# EAGLE design arduino_NGDM (EAGLE 4.14)
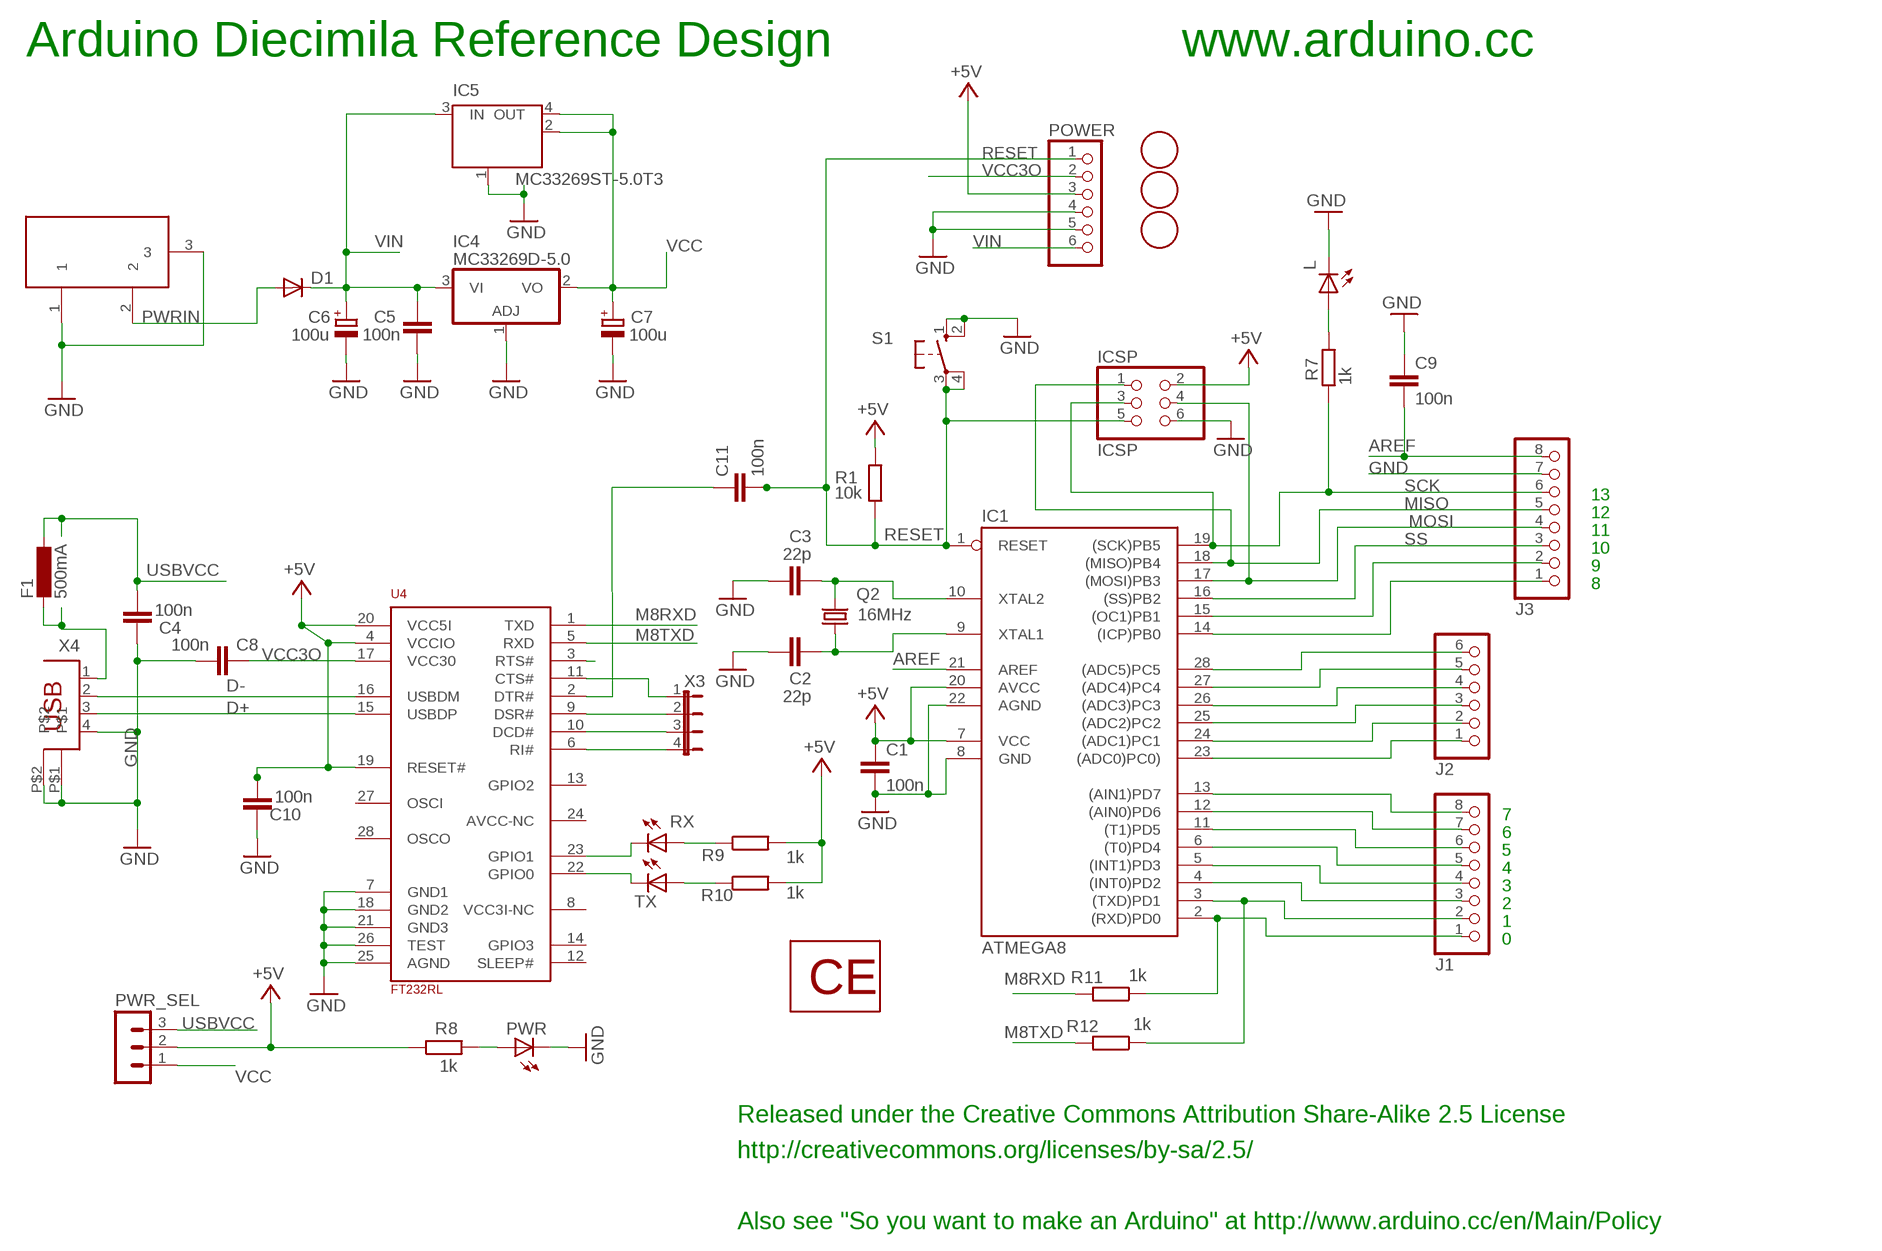
[diagram p0: schematic, sheet 1]

## Parts
C1  100n  C-EU  [C0805RND]
C2  22p  C-EU  [C0805RND]
C3  22p  C-EU  [C0805RND]
C4  100n  C-EU  [C0805RND]
C5  100n  C-EU  [C0805RND]
C6  100u  CPOL-EUD  [PANASONIC_D]
C7  100u  CPOL-EUD  [PANASONIC_D]
C8  100n  C-EU  [C0805RND]
C9  100n  C-EU  [C0805RND]
C10  100n  C-EU  [C0805RND]
C11  100n  C-EU  [C0805RND]
D1  DIODE-SMB  [SMB]
F1  500mA  L-EUL1812  [L1812]
IC1  ATMEGA8  AT90S4433P  [DIL28-3]
IC4  MC33269D-5.0  [DPACK]
IC5  MC33269ST-5.0T3  MC33269ST-3.3T3  [SOT223]
ICSP  ICSP  PINHD-2X3  [2X03]
J1  PINHD-1X8  [1X08]
J2  PINHD-1X6  [1X06]
J3  PINHD-1X8  [1X08]
L  LED0805ROUND  [0805RND]
POWER  PINHD-1X6  [1X06]
PWR  LED0805ROUND  [0805RND]
PWR_SEL  MA03-1  [MA03-1]
Q2  16MHz  CRYTALHC49S  [HC49/S]
R1  10k  R-EU_  [R0805RND]
R7  1k  R-EU_  [R0805RND]
R8  1k  R-EU_  [R0805RND]
R9  1k  R-EU_  [R0805RND]
R10  1k  R-EU_  [R0805RND]
R11  1k  R-EU_  [R0805RND]
R12  1k  R-EU_  [R0805RND]
RX  LED0805ROUND  [0805RND]
S1  10-XX  [B3F-10XX]
TX  LED0805ROUND  [0805RND]
U4  FT232RL  [SSOP28]
U$1  FIDUCIALMOUNT  [FIDUCIA-MOUNT]
U$2  FIDUCIALMOUNT  [FIDUCIA-MOUNT]
U$3  FIDUCIALMOUNT  [FIDUCIA-MOUNT]
U$4  CE  [CE-COPPER]
X2  DC21MMX  [DC-21MM]
X3  JP4E  [JP4]
X4  PN61729  [PN61729]

## Nets
+5V [usbvcc]: C1.1 C10.1 IC1.7(VCC) IC1.20(AVCC) ICSP.2 POWER.3 PWR_SEL.2 R1.2 R8.1 R9.2 R10.2 U4.4(VCCIO) U4.19(RESET#) U4.20(VCC5I)
AREF [aref]: C9.2 IC1.21(AREF) J3.8
D+: U4.15(USBDP) X4.3
D-: U4.16(USBDM) X4.2
GND [gnd]: C1.2 C2.1 C3.1 C4.2 C5.1 C6.- C7.- C8.1 C9.1 C10.2 IC1.8(GND) IC1.22(AGND) IC4.1(ADJ) IC5.1(GND/ADJ) ICSP.6 J3.7 L.P$2(C) POWER.4 POWER.5 PWR.P$2(C) S1.1(S) S1.2(S1) U4.7(GND1) U4.18(GND2) U4.21(GND3) U4.25(AGND) U4.26(TEST) X2.1 X2.3 X4.4 X4.P$1 X4.P$2
M8RXD: R11.2 U4.1(TXD)
M8TXD: R12.2 U4.5(RXD)
MISO: IC1.18((MISO)PB4) ICSP.1 J3.5
MOSI: IC1.17((MOSI)PB3) ICSP.4 J3.4
N$2: L.P$1(A) R7.1
N$3: PWR.P$1(A) R8.2
N$5: IC1.14((ICP)PB0) J3.1
N$6: C2.2 IC1.9(XTAL1) Q2.1
N$7: C3.2 IC1.10(XTAL2) Q2.2
N$8 [usbvcc]: F1.2 X4.1
N$9: U4.3(RTS#)
N$10: IC1.4((INT0)PD2) J1.3
N$11: IC1.5((INT1)PD3) J1.4
N$12: IC1.6((T0)PD4) J1.5
N$13: IC1.11((T1)PD5) J1.6
N$14: IC1.12((AIN0)PD6) J1.7
N$15: IC1.13((AIN1)PD7) J1.8
N$16: IC1.23((ADC0)PC0)) J2.1
N$17: IC1.24((ADC1)PC1) J2.2
N$18: IC1.25((ADC2)PC2) J2.3
N$19: IC1.26((ADC3)PC3) J2.4
N$20: IC1.27((ADC4)PC4) J2.5
N$21: IC1.28((ADC5)PC5) J2.6
N$22: IC1.15((OC1)PB1) J3.2
N$24: C11.1 U4.2(DTR#)
N$32: RX.P$2(C) U4.23(GPIO1)
N$34: TX.P$2(C) U4.22(GPIO0)
N$35: R9.1 RX.P$1(A)
N$36: R10.1 TX.P$1(A)
N$37: U4.6(RI#) X3.4
N$38: U4.10(DCD#) X3.3
N$39: U4.11(CTS#) X3.1
N$40: U4.9(DSR#) X3.2
PD0: IC1.2((RXD)PD0) J1.1 R11.1
PD1: IC1.3((TXD)PD1) J1.2 R12.1
PWRIN [power]: D1.A X2.2
RESET: C11.2 IC1.1(RESET) ICSP.5 POWER.1 R1.1 S1.3(P) S1.4(P1)
SCK: IC1.19((SCK)PB5) ICSP.3 J3.6 R7.2
SS: IC1.16((SS)PB2) J3.3
USBVCC [usbvcc]: C4.1 F1.1 PWR_SEL.3
VCC [usbvcc]: C7.+ IC4.2(VO) IC5.2(OUT) IC5.4(OUT) PWR_SEL.1
VCC3O: C8.2 POWER.2 U4.17(VCC30)
VIN [power]: C5.2 C6.+ D1.C IC4.3(VI) IC5.3(IN) POWER.6
Unconnected: U4.8(VCC3I-NC) U4.12(SLEEP#) U4.13(GPIO2) U4.14(GPIO3) U4.24(AVCC-NC) U4.27(OSCI) U4.28(OSCO)

## Notes on the sheet
- Arduino Diecimila Reference Design | www.arduino.cc
- 13
- 12
- 11
- 10
- 9
- 8
- 7
- 6
- 5
- 4
- 3
- 2
- 1
- 0
- Released under the Creative Commons Attribution Share-Alike 2.5 License
- http://creativecommons.org/licenses/by-sa/2.5/
- Also see "So you want to make an Arduino" at http://www.arduino.cc/en/Main/Policy

## Library data of the parts
C1-C5 C8-C11 = rcl:C-EU: CAPACITOR, European symbol
C6 C7 = rcl:CPOL-EU: POLARIZED CAPACITOR, European symbol
D1 = diode:DIODE-: DIODE
F1 = rcl:L-EU: INDUCTOR, European symbol
IC1 = atmel:AT90S4433: MICROCONTROLLER 4 Kbytes FLASH 128 bytes SRAM 256 bytes EEPROM UART 6-channel 10 bit ADC
IC4 = linear:MC33269?*: Adjustable Output Low Dropout Voltage Regulator 800 mA Source: http://www.onsemi.com/pub/Collateral/MC33269-D.PDF
IC5 = linear:MC33269ST*: Adjustable Output Low Dropout Voltage Regulator 800 mA Source: http://www.onsemi.com/pub/Collateral/MC33269-D.PDF
ICSP = pinhead:PINHD-2X3: PIN HEADER
J1 J3 = pinhead:PINHD-1X8: PIN HEADER
J2 POWER = pinhead:PINHD-1X6: PIN HEADER
L PWR RX TX = led:LED: LED OSRAM: - CHIPLED LG R971, LG N971, LY N971, LG Q971, LY Q971, LO R971, LY R971 LH N974, LH R974 LS Q976, LO Q976, LY Q976 LO Q996 - Hyper CHIPLED LW Q18S LB Q993, LB Q99A, LB R99A - SideLED LS A670, LO A670, LY A670, LG A670, LP A670 LB A673, LV A673, LT A673, LW A673 LH A674 LY A675 LS A676, LA A676, LO A676, LY A676, LW A676 LS A679, LY A679, LG A679 - Hyper Micro SIDELED® LS Y876, LA Y876, LO Y876, LY Y876 LT Y87S - SmartLED LW L88C, LW L88S LB L89C, LB L89S, LG L890 LS L89K, LO L89K, LY L89K LS L896, LA L896, LO L896, LY L896 - TOPLED LS T670, LO T670, LY T670, LG T670, LP T670 LSG T670, LSP T670, LSY T670, LOP T670, LYG T670 LG T671, LOG T671, LSG T671 LB T673, LV T673, LT T673, LW T673 LH T674 LS T676, LA T676, LO T676, LY T676, LB T676, LH T676, LSB T676, LW T676 LB T67C, LV T67C, LT T67C, LS T67K, LO T67K, LY T67K, LW E67C LS E67B, LA E67B, LO E67B, LY E67B, LB E67C, LV E67C, LT E67C LW T67C LS T679, LY T679, LG T679 LS T770, LO T770, LY T770, LG T770, LP T770 LB T773, LV T773, LT T773, LW T773 LH T774 LS E675, LA E675, LY E675, LS T675 LS T776, LA T776, LO T776, LY T776, LB T776 LHGB T686 LT T68C, LB T68C - Hyper Mini TOPLED® LB M676 - Mini TOPLED Santana® LG M470 LS M47K, LO M47K, LY M47K Source: http://www.osram.convergy.de/
PWR_SEL = con-lstb:MA03-1: PIN HEADER
Q2 = crystal:CRYTAL: CRYSTAL
R1 R7-R12 = rcl:R-EU_: RESISTOR, European symbol
S1 = switch-omron:10-XX: OMRON SWITCH
U4 = SmartPrj:FT232RL
U$1-U$3 = SmartPrj:FIDUCIALMOUNT
U$4 = SmartPrj:CE
X2 = powersupply:DC21MM
X3 = jumper:JP4E: JUMPER
X4 = SmartPrj:PN61729: BERG USB connector

## Net classes
0 default: width 0.254 mm, drill 0.254 mm
1 power: width 0.61 mm, drill 0.33 mm, clearance 0.711 mm
2 gnd: width 0.305 mm, drill 0.254 mm, clearance 0.711 mm
3 usbvcc: width 0.508 mm, drill 0.254 mm, clearance 0.711 mm
4 aref: width 0.406 mm

## Board
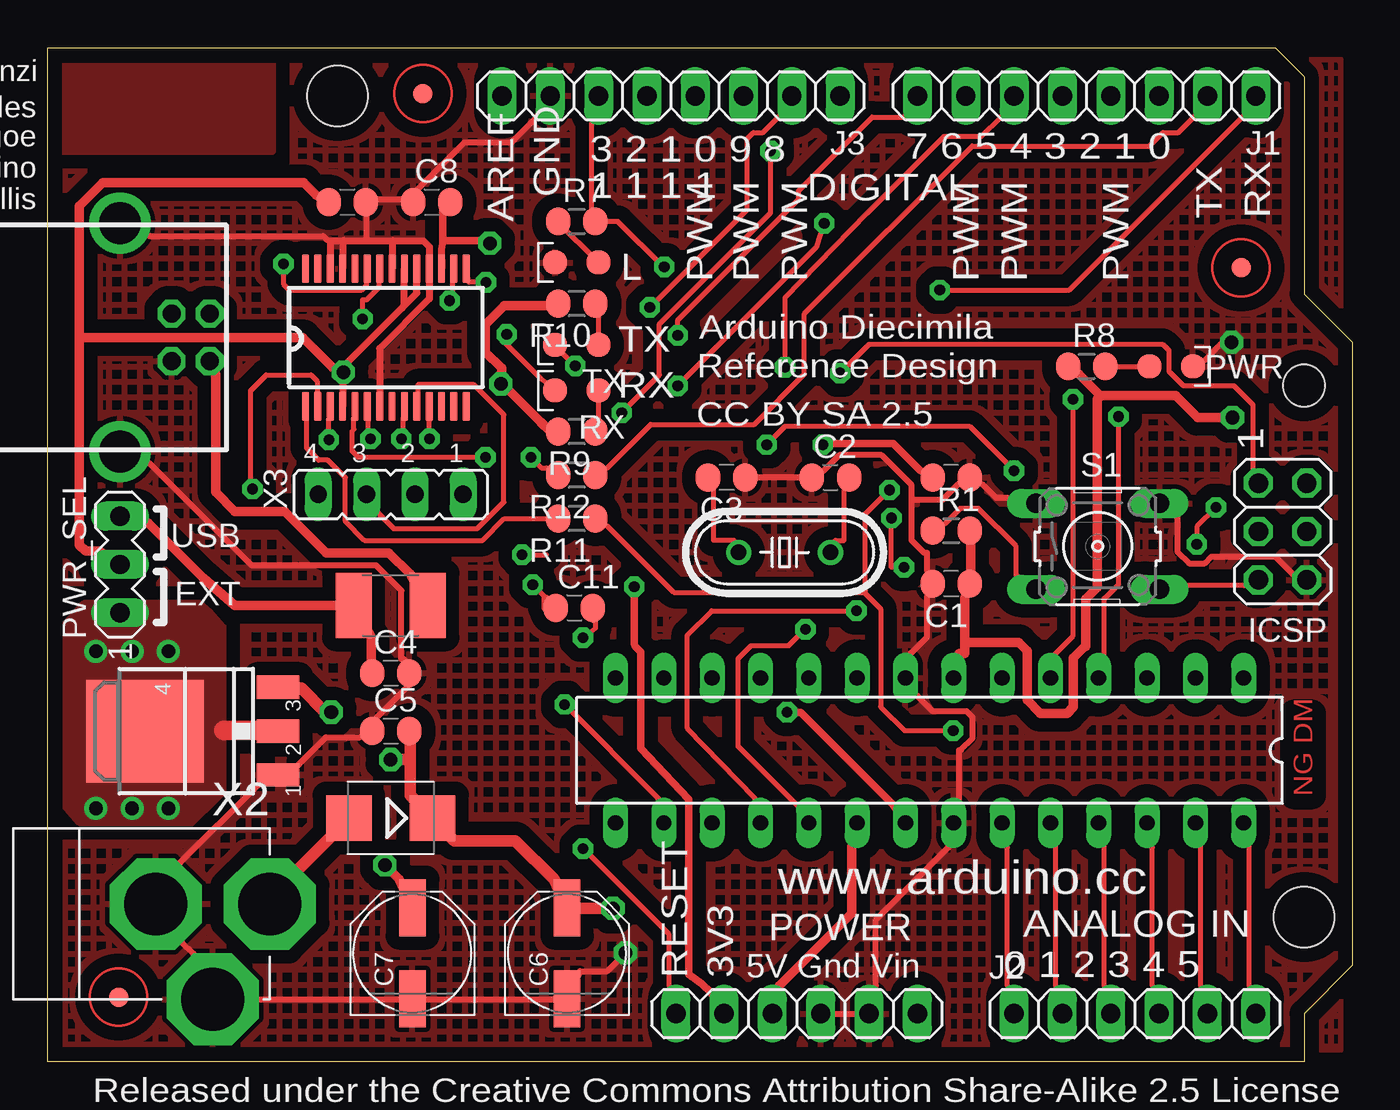
[diagram p1: board, top side]
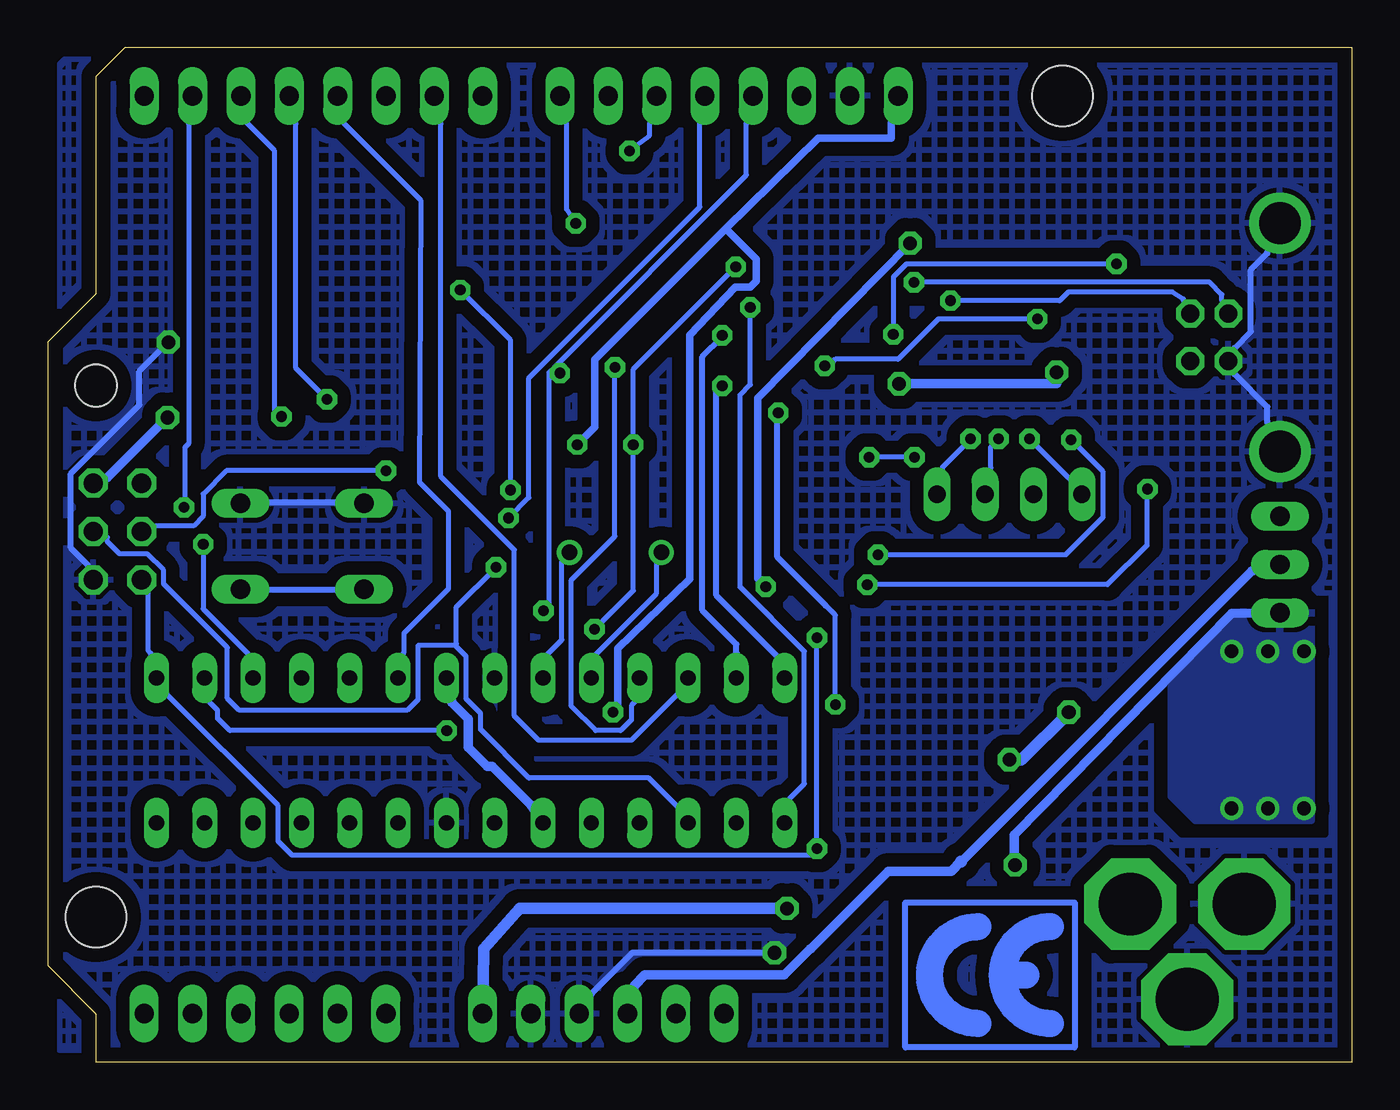
[diagram p2: board, bottom side, seen from below]

Size 68.58 x 53.34 mm. Coordinates in mm from the lower left corner, seen from the top.
Outline: 0,53.34 64.52,53.34 66.04,51.82 66.04,40.39 68.58,37.85 68.58,5.08 66.04,2.54 66.04,0 0,0 0,53.34
Copper layers (1*16): Top 0.035mm / dielectric 1.5mm / Bottom 0.035mm
Design rules "default": minimum track width 10mil, minimum drill 22mil, track to track 10mil, track to pad 10mil, pad to pad 10mil, via to via 16mil, smd to smd 8mil, copper to edge 30mil, drill to drill 12mil, minimum pad ring 10mil, minimum via ring 10mil, stop-mask expansion 4mil, vias tented up to drill 0mil, thermal gap 10mil
Holes 2.2 mm at 66.04,35.56
Holes 3.2 mm at 66.04,7.62 15.24,50.8
vRestrict: area 22.9,44.1 to 24.6,49.1; area 25.4,45.5 to 27.1,49.1; area 28.4,45.3 to 29.6,48.8; area 31,45.3 to 32.1,48.8; area 33.5,45.3 to 34.7,48.8; area 36.1,45.3 to 37.2,48.8; area 38.7,47.2 to 39.9,48.8; area 40.3,45.1 to 47.6,46.9; area 33.4,41 to 34.9,44.6; area 35.9,41 to 37.5,44.6; area 38.5,41 to 40,44.6; area 47.5,41 to 49,44.6; 37 more areas

### Footprints (pad centres in the part's own frame; a part is rotated, then mirrored left to right if it is on the bottom)
C0805RND = smd 1.3 x 1.5: 1 -0.977,0; 2 0.977,0
PANASONIC_D = smd 3 x 1.4: + 2.4,0; - -2.4,0
SMB = smd 2.4 x 2.4: A 2.2,0; C -2.2,0
L1812 = smd 1.9 x 3.4: 1 -1.95,0; 2 1.95,0
DIL28-3 = drill 0.813 long: 1 -16.51,-3.81; 2 -13.97,-3.81; 3 -11.43,-3.81; 4 -8.89,-3.81; 5 -6.35,-3.81; 6 -3.81,-3.81; 7 -1.27,-3.81; 8 1.27,-3.81; 9 3.81,-3.81; 10 6.35,-3.81; 11 8.89,-3.81; 12 11.43,-3.81; 13 13.97,-3.81; 14 16.51,-3.81; 15 16.51,3.81; 16 13.97,3.81; 17 11.43,3.81; 18 8.89,3.81; 19 6.35,3.81; 20 3.81,3.81; 21 1.27,3.81; 22 -1.27,3.81; 23 -3.81,3.81; 24 -6.35,3.81; 25 -8.89,3.81; 26 -11.43,3.81; 27 -13.97,3.81; 28 -16.51,3.81
DPACK = smd 1 x 1.6: 1 -2.28,-4.8; 3 2.28,-4.8 | smd 5.4 x 6.2: 2 0,2.5
SOT223 = smd 1.219 x 2.235: 1 -2.311,-3.099; 2 0,-3.099; 3 2.311,-3.099 | smd 3.6 x 2.2: 4 0,3.099
2X03 = drill 1.016 octagon: 1 -2.54,-1.27; 2 -2.54,1.27; 3 0,-1.27; 4 0,1.27; 5 2.54,-1.27; 6 2.54,1.27
1X08 = drill 1.016 long: 1 -8.89,0; 2 -6.35,0; 3 -3.81,0; 4 -1.27,0; 5 1.27,0; 6 3.81,0; 7 6.35,0; 8 8.89,0
1X06 = drill 1.016 long: 1 -6.35,0; 2 -3.81,0; 3 -1.27,0; 4 1.27,0; 5 3.81,0; 6 6.35,0
0805RND = smd 1.27 x 1.27: P$1 -1.143,0; P$2 1.143,0
MA03-1 = drill 1.016 long: 1 -2.54,0; 2 0,0; 3 2.54,0
HC49/S = drill 0.813 round: 1 -2.413,0; 2 2.413,0
R0805RND = smd 1.3 x 1.5: 1 -0.977,0; 2 0.977,0
B3F-10XX = drill 1.016 long: 1 -3.251,2.261; 2 3.251,2.261; 3 -3.251,-2.261; 4 3.251,-2.261
SSOP28 = smd 0.381 x 1.499: 1 -4.225,-3.625; 2 -3.575,-3.625; 3 -2.925,-3.625; 4 -2.275,-3.625; 5 -1.625,-3.625; 6 -0.975,-3.625; 7 -0.325,-3.625; 8 0.325,-3.625; 9 0.975,-3.625; 10 1.625,-3.625; 11 2.275,-3.625; 12 2.925,-3.625; 13 3.575,-3.625; 14 4.225,-3.625; 15 4.225,3.625; 16 3.575,3.625; 17 2.925,3.625; 18 2.275,3.625; 19 1.625,3.625; 20 0.975,3.625; 21 0.325,3.625; 22 -0.325,3.625; 23 -0.975,3.625; 24 -1.625,3.625; 25 -2.275,3.625; 26 -2.925,3.625; 27 -3.575,3.625; 28 -4.225,3.625
FIDUCIA-MOUNT = smd 1.016 x 1.016: P$1 0,0
DC-21MM = drill 3.302 pad 4.826 octagon: 1 -5.08,-3.353; 2 -0.076,-6.35; 3 -0.076,-0.356
JP4 = drill 0.914 long: 1 -3.81,0; 2 -1.27,0; 3 1.27,0; 4 3.81,0
PN61729 = drill 0.95 octagon: 1 1.25,4.71; 2 -1.25,4.71; 3 -1.25,2.71; 4 1.25,2.71 | drill 2.2 round: P$1 -6,0; P$2 6,0

### Placement (x,y rotation side)
C1  47.5,25.15 180 top
C2  41.15,30.73 0 top
C3  35.69,30.73 180 top
C4  18.03,20.45 0 top
C5  18.03,17.4 0 top
C6  27.3,5.71 90 top
C7  19.18,5.71 90 top
C8  20.19,45.21 0 top
C9  47.5,30.73 180 top
C10  15.75,45.21 0 top
C11  27.69,23.88 0 top
D1  18.03,12.83 180 top
F1  18.03,24 0 top
IC1  46.35,16.38 180 top
IC4  7.62,17.4 90 top
IC5  9.02,17.4 90 top
ICSP  64.91,27.89 270 top
J1  54.61,50.8 180 top
J2  57.15,2.54 0 top
J3  32.77,50.8 180 top
L  27.81,42.04 180 top
POWER  39.37,2.54 0 top
PWR  59.05,36.58 0 top
PWR_SEL  3.81,26.16 90 top
Q2  38.73,26.8 180 top
R1  47.5,27.94 0 top
R7  27.81,44.2 0 top
R8  54.61,36.58 0 top
R9  27.81,33.15 180 top
R10  27.81,39.88 180 top
R11  27.81,28.57 180 top
R12  27.81,30.86 180 top
RX  27.81,35.31 180 top
S1  55.2,27.11 0 top
TX  27.81,37.72 180 top
U4  17.78,38.1 0 top
U$1  19.73,50.92 0 top
U$2  62.73,41.76 0 top
U$3  3.73,3.41 0 top
U$4  23.5,0.76 0 bottom
X2  5.33,8.38 90 top
X3  18.03,29.84 180 top
X4  3.81,38.1 270 top

### Tracks (layer width: path | path; a pad name or v marks a point on that pad's centre or on a via)
+5V  (via drill 0.71)
  Top 0.381: U4.4 15.51,36.27 15.51,36.54 18.59,39.62 | 18.59,39.62 19.41,40.44 U4.19 19.41,41.68 | U4.20 18.75,39.79 18.59,39.62
  Top 0.508: 23.88,36.47 23.01,37.34 23.01,38.78 24.01,39.78 26.21,39.78 R10.2 | 23.88,36.47 23.88,35.69 25.91,33.66 26.39,33.2 R9.2 | v23.82,35.66 23.88,36.47 | 15.51,36.27 v15.54,36.27 14.99,36.52 13.41,38.1 1.68,38.1 | 1.68,38.1 1.68,45.01 2.9,46.23 13.46,46.23 14.12,45.57 C10.1 | 1.68,38.1 1.68,27.19 1.99,26.87 2.69,26.87 PWR_SEL.2 | 55.32,35.05 54.2,36.17 R8.1 | 55.32,35.05 59.28,35.05 60.45,33.88 v62.28,33.88 | R1.2 48.51,27.23 48.51,25.86 C1.1 48.21,24.43 48.21,22.05 | 48.21,22.05 48.21,21.49 47.9,21.49 IC1.7 | POWER.3 38.46,4.01 42.27,7.82 42.27,11.28 IC1.20 | 55.32,35.05 55.17,34.85 55.17,24.94 54.56,24.33 54.56,21.84 54.51,21.84 53.9,21.23 53.9,18.66 53.58,18.34 52.17,18.34 51.49,19.02 51.49,21.6 51.04,22.05 48.21,22.05
  Bottom 0.406: 28.47,5.94 28.5,5.94
  Bottom 0.508: v23.82,35.66 15.54,35.66 v15.54,36.27 | v62.28,33.88 65.43,30.73 ICSP.2 | IC1.20 43.18,13.51 45.21,15.54 45.48,15.54 46.48,16.55 46.48,18.03 47.35,18.9 IC1.7 | 20.56,10.53 5.28,25.81 PWR_SEL.2 | 28.5,5.94 29.87,4.57 37.19,4.57 37.74,4.01 POWER.3 | 28.47,5.94 24.38,10.03 21.08,10.03 20.57,10.54
  Bottom 0.61: 20.56,10.53 20.57,10.54
AREF  (via drill 0.56)
  Top 0.406: v40.74,32.46 40.79,32.51 44.45,32.51 45.87,31.09 C9.2 | v38.86,18.39 39.57,18.39 44.45,13.51 IC1.21
  Bottom 0.406: v40.74,32.46 39.83,33.38 39.83,36.93 32.94,43.81 | 32.94,43.81 28.07,48.56 24.23,48.56 24.23,49.33 J3.8 | v38.86,18.39 38.61,18.64 38.61,21.74 34.82,25.4 34.82,38.23 32.44,40.74 31.66,40.74 31.34,41.06 31.34,42.22 32.94,43.81
D+  (via drill 0.56)
  Top 0.254: v23.04,41 22.15,41 U4.15
  Bottom 0.254: v23.04,41 7.49,41 6.86,40.36 6.86,40.03 X4.3
D-  (via drill 0.56)
  Top 0.254: v21.13,40.03 21.29,40.03 21.29,41 U4.16
  Bottom 0.254: v21.13,40.03 15.39,40.03 14.94,40.49 9.46,40.49 8.88,40.12 X4.2
GND  (via drill 0.71)
  Top 0.305: POWER.4 POWER.5 43.54,4.01 43.54,7.47 47.35,11.28 IC1.22 47.9,13.87 47.9,16.41 48.01,16.41 48.62,17.02 48.62,18.12 48.3,18.44 46.53,18.44 45.72,19.25 IC1.8 45.36,21.49 46.23,22.35 46.23,24.43 C1.2 46.23,25.86 46.23,26.77 46.08,26.77 45.41,27.43 45.41,29.57 | v62.23,37.85 61.77,37.85 60.81,36.88 PWR.P$2 | C3.1 C2.1 40.79,31.09 41.6,31.9 43.84,31.9 45.41,30.33 45.41,29.57 | S1.1 50.44,29.67 49.84,29.67 49.12,30.38 C9.1 47.85,30.38 47.04,29.57 45.41,29.57 | ICSP.6 65.43,25.65 64.52,26.57 61.16,26.57 60.81,26.21 59.99,26.21 59.38,26.82 59.38,28.65 S1.2 | 16.76,43.18 16.76,44.5 C10.2 17.37,45.36 18.59,45.36 C8.1 19.23,45.67 21.92,48.36 24.38,48.36 25.7,49.68 J3.7 | 14.86,43.18 14.68,43.23 14.48,43.43 5.38,43.43 X4.P$1 | IC4.1 12.45,15.14 IC5.1 | IC5.1 13.21,15.65 14.63,17.07 16.41,17.07 C5.1 17.32,18.14 18.9,19.71 C4.2 18.75,21.18 18.59,21.18 18.59,24.79 17.27,26.11 10.72,26.11 5.38,31.45 X4.P$2 | IC5.1 11.02,14.53 6.96,10.46 6.91,10.46 X2.3 7.06,6.3 7.67,5.69 X2.1 18.49,3.3 C7.- 19.86,3.3 26.62,3.3 C6.- 27.99,4.78 29.41,4.78 v30.38,5.74
  Top 0.381: U4.7 17.45,37.52 20.07,40.13 20.07,41.73 20.06,41.73 U4.18 20.05,41.78 20.07,41.78 20.07,42.86 19.75,43.18 18.16,43.18 | U4.21 18.11,43.18 18.16,43.18 | U4.26 14.86,43.18 15.62,43.18 | 18.16,43.18 16.76,43.18 15.62,43.18 | U4.25 15.51,43.18 15.62,43.18
  Bottom 0.305: v62.23,37.85 63.75,36.32 63.75,34.54 67.36,30.94 67.36,27.03 66.45,26.11 ICSP.6 | S1.2 56.95,29.41 53.44,29.41 S1.1 | X4.P$2 4.47,33.68 4.47,34.44 6.2,36.17 X4.4 6.2,37.54 5.33,38.41 5.33,41.66 4.47,42.52 X4.P$1 | v30.38,5.74 37.85,5.74 39.93,3.66 POWER.4
  pour Bottom (isolate 0.406, rank 2, hatched): 0.64,52.7 67.69,52.7 67.94,52.45 67.94,0.64 0.89,0.64 0.64,0.89
  pour Top (isolate 0.406, rank 2, hatched): 0.64,52.7 67.94,52.7 67.94,0.64 0.64,0.64
M8RXD
  Top 0.254: U4.1 13.61,33.73 13.61,32.28 14.25,31.65 14.73,31.65 15.65,30.73 15.65,28.43 16.65,27.43 22.86,27.43 24,28.57 R11.2
M8TXD  (via drill 0.56)
  Top 0.254: v23.01,31.8 16.32,31.8 16,32.12 16,33.17 16.1,33.27 16.1,33.73 U4.5 | v25.4,31.8 25.96,31.24 26.21,31.24 R12.2
  Bottom 0.254: v23.01,31.8 v25.4,31.8
MISO  (via drill 0.56)
  Top 0.254: v42.52,23.72 34.9,23.72 33.63,22.45 33.63,17.55 37.19,13.87 IC1.18 | v41.66,36.22 43.18,37.74 58.61,37.74 58.93,37.43 58.93,36.32 59.69,35.56 62.35,35.56 63.35,34.56 63.35,31.19 ICSP.1
  Bottom 0.254: v42.52,23.72 42.22,24.03 42.22,36.27 41.94,36.55 | 41.94,36.55 31.85,46.63 31.85,49.33 J3.5 | v41.66,36.22 41.86,36.42 41.86,36.47 41.94,36.55
MOSI  (via drill 0.56)
  Top 0.254: v44.35,28.6 44.35,26.01 v45.01,26.01
  Bottom 0.254: 47.14,21.89 46.58,21.34 46.58,19.1 45.82,18.34 45.82,17.48 43.28,14.94 36.98,14.94 35.56,13.51 IC1.17 | 47.14,21.89 49.12,21.89 49.12,19.05 49.68,18.49 58.5,18.49 59.13,19.13 59.13,21.79 62.48,25.15 62.48,25.86 63.35,26.72 64.8,26.72 65.43,27.36 65.43,27.58 ICSP.4 | v44.35,28.6 43.28,29.67 43.28,35.97 34.29,44.96 34.29,49.33 J3.4 | v45.01,26.01 47.09,23.93 47.09,22 47.14,21.89
N$2
  Top 0.254: R7.1 26.8,44.2 L.P$1
N$3
  Top 0.254: R8.2 PWR.P$1
N$5  (via drill 0.56)
  Top 0.254: v33.12,35.56 40.44,42.88 v40.82,44.09
  Bottom 0.254: 33.43,35.26 v33.12,35.56 | v40.82,44.09 41.3,44.83 41.3,49.33 J3.1
  Bottom 0.305: 33.43,35.26 33.43,24.54 29.72,20.83 29.72,20.19 IC1.14
N$6
  Top 0.254: C2.2 41.86,30.02 41.86,27.43 41.4,27.43 Q2.1
  Bottom 0.254: IC1.9 42.27,21.49 41.55,22.2 41.55,26.31 Q2.1
N$7
  Top 0.254: C3.2 35,30.02 35,27.43 36.07,27.43 Q2.2
  Bottom 0.254: IC1.10 39.73,21.49 36.58,24.64 36.58,26.16 Q2.2
N$8
  Top 0.508: X4.1 8.84,36.17 8.84,29.96 9.84,28.96 12.47,28.96 14.66,26.77 17.93,26.77 19.05,25.65 F1.2
N$9  (via drill 0.56)
  Top 0.254: v14.78,32.72 14.78,33.73 U4.3 | v24.94,26.67 26.21,26.67
  Bottom 0.254: v14.78,32.72 13.11,31.04 13.11,28.65 15.09,26.67 v24.94,26.67
N$10  (via drill 0.56)
  Top 0.254: v56.29,33.93 56.29,25.09 55.58,24.38 55.52,24.38 55.52,21.49 IC1.4
  Bottom 0.254: v56.29,33.93 56.64,34.29 56.64,47.9 58.06,49.33 J1.3
N$11  (via drill 0.56)
  Top 0.254: v53.9,34.85 53.9,22.4 52.98,21.49 IC1.5
  Bottom 0.254: v53.9,34.85 55.52,36.47 55.52,49.33 J1.4
N$12
  Bottom 0.254: IC1.6 49.89,21.49 49.84,21.54 49.84,22.55 47.5,24.89 47.5,28.96 49.02,30.48 48.95,45.29 52.98,49.33 J1.5
N$13  (via drill 0.56)
  Top 0.254: v38.76,36.52 38.76,40.18 43.08,44.63 47.12,48.67 49.07,48.67 50.09,49.68 J1.6
  Bottom 0.254: v38.76,36.52 38.76,27.64 41.05,25.35 41.05,18.69 39.78,17.42 38.46,17.42 37.9,17.98 37.9,18.75 37.74,18.9 IC1.11
N$14
  Bottom 0.254: IC1.12 35.56,19.25 37.9,16.92 42.77,16.92 44.04,18.19 44.04,26.92 47.9,30.79 47.9,49.33 J1.7
N$15  (via drill 0.56)
  Top 0.254: v33.12,38.2 33.12,39.01 39.47,45.36 39.47,45.82 42.55,48.9 | 42.55,48.9 42.52,48.87 | 42.55,48.9 43.33,49.68 45.01,49.68 J1.8
  Bottom 0.254: IC1.13 32.44,20.19 32.31,21.49
  Bottom 0.305: v33.12,38.2 33.12,38.12 34.16,37.08 34.16,23.75 32.38,21.97 32.44,20.19
N$16
  Top 0.254: IC1.23 50.44,11.28 50.44,4.01 J2.1
N$17
  Top 0.254: IC1.24 52.98,11.28 52.98,4.01 J2.2
N$18
  Top 0.254: IC1.25 55.52,11.28 55.52,4.01 J2.3
N$19
  Top 0.254: IC1.26 58.06,11.28 58.06,4.01 J2.4
N$20
  Top 0.254: IC1.27 60.6,11.28 60.6,4.01 J2.5
N$21
  Top 0.254: IC1.28 63.14,11.28 63.14,4.01 J2.6
N$22  (via drill 0.56)
  Top 0.254: v31.65,39.67 36.78,44.81 36.78,48.55 37.1,48.87 37.59,48.87 38.41,49.68 J3.2
  Bottom 0.254: v31.65,39.67 31.65,35.61 32.18,35.08 32.18,24.97 28.8,21.59 28.8,14.63 29.57,13.87 IC1.15
N$24  (via drill 0.56)
  Top 0.254: v10.77,30.12 10.67,30.12 10.67,35.31 11.48,36.12 13.86,36.12 14.17,35.8 14.17,35.2 U4.2 | v25.5,25.09 26.21,24.38
  Top 0.406: 26.21,24.38 26.16,24.38 26.16,23.88 C11.1
  Bottom 0.254: v25.5,25.09 12.88,25.09 10.79,27.18 10.79,30.1 v10.77,30.12 10.67,30.23
N$27
  pour Top: 0.64,52.58 11.81,52.58 11.81,47.88 0.64,47.88
N$32  (via drill 0.56)
  Top 0.254: v24.13,38.25 24.13,37.72 25.91,35.94 26.49,35.51 RX.P$2 | v12.39,41.96 12.39,40.91 12.71,40.59 16.51,40.59 16.76,40.84 16.76,41 U4.23
  Bottom 0.254: v24.13,38.25 24.13,41.27 23.44,41.96 v12.39,41.96
N$34  (via drill 0.56)
  Top 0.254: v27.74,36.6 27.03,37.31 TX.P$2 | v16.56,39.06 16.56,40.08 16.76,40.08 17.42,40.74 17.42,41 U4.22
  Bottom 0.254: v16.56,39.06 21.77,39.06 23.88,36.96 27.18,36.96 27.41,36.73 | 27.41,36.73 27.81,36.7 | 27.41,36.73 v27.74,36.6
N$35
  Top 0.254: RX.P$1 28.96,33.88 R9.1
N$36
  Top 0.254: TX.P$1 28.96,39.42 R10.1
N$37  (via drill 0.56)
  Top 0.254: v16.97,32.77 16.87,32.77 16.87,33.73 U4.6
  Bottom 0.254: v16.97,32.77 14.88,30.68 X3.4
N$38
  Top 0.254: U4.10 19.46,35.2 19.46,35.61 22.4,35.61 23.98,34.04 23.98,29.44 22.58,28.04 18.19,28.04 17.42,28.8 X3.3
N$39  (via drill 0.56)
  Top 0.254: v20.07,32.77 20.07,33.73 U4.11
  Bottom 0.254: v20.07,32.77 21.54,31.29 21.54,31.24 X3.1
N$40  (via drill 0.56)
  Top 0.254: v18.59,32.77 18.69,32.77 18.69,33.73 U4.9
  Bottom 0.254: v18.59,32.77 19,32.36 19,31.24 X3.2
PD0  (via drill 0.56)
  Top 0.254: 42.93,24.69 32.92,24.69 29.41,28.19 R11.1 | 42.93,24.69 43.79,23.82 43.79,18.68 45.04,17.42 v47.6,17.42 | v46.89,40.59 53.7,40.59 62.79,49.68 J1.1 | v44.25,30.07 42.98,28.8 42.98,24.79 42.93,24.69
  Bottom 0.254: v47.6,17.42 59,17.42 59.64,18.06 59.64,18.49 60.05,18.9 IC1.2 | v46.89,40.59 44.25,37.95 v44.25,30.07
PD1  (via drill 0.56)
  Top 0.254: R12.1 29.41,31.24 31.7,33.53 37.13,33.53 39.78,36.17 39.78,39.35 48.59,48.16 57.91,48.16 58.62,48.87 59.44,48.87 60.25,49.68 J1.2 | v60.4,27.23 60.4,28.14 v61.42,29.16
  Bottom 0.254: v60.4,27.23 60.4,23.82 58.06,21.49 IC1.3 | v61.42,29.16 61.37,29.21 61.37,32.31 61.16,32.51 61.16,49.33 J1.2
PWRIN
  Top 0.61: D1.A 14.68,11.63 13.21,10.16 X2.2
RESET  (via drill 0.56)
  Top 0.254: R1.1 47.14,28.3 47.95,29.11 48.92,29.11 50.9,27.13 50.9,25.6 S1.3 | S1.4 59.94,25.04 62.89,25.04 ICSP.5 | 28.8,23.77 28.8,22.81 v28.14,22.3 | v28.14,11.23 32.66,6.71 32.66,4.01 POWER.1
  Top 0.406: 28.8,23.77 28.7,23.27 28.7,23.88 C11.2
  Bottom 0.254: ICSP.5 63.3,24.64 63.3,21.64 63.14,21.49 IC1.1 62.23,19.25 56.46,13.49 56.46,11.61 55.73,10.87 28.5,10.87 v28.14,11.23 v28.14,22.3
  Bottom 0.305: S1.4 58.42,24.83 58.42,24.77 58.33,24.85 S1.3
SCK  (via drill 0.56)
  Top 0.254: v39.83,22.76 38.96,21.89 36.98,21.89 36.3,21.21 36.3,16.59 39.37,13.51 IC1.19 | v50.8,31.09 48.46,33.43 38.76,33.43 v37.8,32.46 | 28.6,47.37 28.6,49.33 J3.6 | 28.6,47.37 28.57,47.37 | 28.6,47.37 28.6,44.3 28.7,44.2 R7.2 29.97,44.2 32.38,41.78 v32.41,41.81
  Bottom 0.254: v32.41,41.81 37.8,36.42 v37.8,32.46 37.8,24.79 v39.83,22.76 | v50.8,31.09 59.18,31.09 60.4,29.87 60.4,28.7 60.91,28.19 62.89,28.19 ICSP.3
SS  (via drill 0.56)
  Top 0.254: v27.18,18.8 32.11,13.87 IC1.16 | v30.18,34.14 32.16,36.12 32.16,38.81 38,44.65 v38,47.9
  Bottom 0.254: v27.18,18.8 27.18,23.5 27.69,24 | v38,47.9 36.93,48.72 36.93,49.33 J3.3
  Bottom 0.305: 27.69,24 30.23,26.54 30.23,34.16 30.2,34.14 v30.18,34.14
USBVCC
  Top 0.508: C4.1 17.02,21.18 17.02,22.35 F1.1 9.83,24 8.18,25.45 5.28,28.35 PWR_SEL.3
VCC  (via drill 0.71)
  Top 0.508: 11.02,17.42 IC5.2 | v17.73,10.36 18.49,9.6 C7.+
  Top 1.016: 9.27,17.42 11.02,17.42
  Bottom 0.508: v17.73,10.36 17.73,10.41 17.78,10.41 17.78,11.94 6.35,23.57 PWR_SEL.1
  other vias: 2.54,21.59 4.45,21.59 6.35,21.59 2.54,13.34 4.45,13.34 6.35,13.34
  pour Top (isolate 0.305, no thermals): 8,12.57 9.27,13.72 9.27,22.86 8.13,24.13 1.91,24.13 0.64,22.73 0.64,13.72 1.65,12.57
  pour Bottom: 2.16,12.7 2.16,24.13 5.71,24.13 9.53,20.32 9.53,13.97 8.26,12.7
VCC3O  (via drill 0.56, 0.71)
  Top 0.254: 30.89,21.84 30.84,21.97
  Top 0.381: 20.78,43.18 20.7,42.72 U4.17
  Top 0.406: C8.2 20.78,44.76 20.78,43.18 23.11,43.18 v23.24,43.05 | 30.84,21.97 v30.84,24.99 | 30.89,21.84 31.17,21.57 31.17,16.48 33.71,13.82 33.71,4.62 34.39,4.12 34.85,3.66 POWER.2
  Bottom 0.406: v23.24,43.05 31.27,34.9 31.27,25.43 v30.84,24.99
VIN  (via drill 0.71)
  Top 0.61: IC4.3 12.45,19.71 IC5.3 13.34,19.66 14.61,18.39 v14.91,18.39 | 19.05,15.9 19.05,14.02 D1.C 21.39,11.63 24.59,11.63 26.62,9.6 C6.+ 27.99,8.08 v29.72,8.08 | 19.05,15.9 19.05,16.66 C5.2 | v18.03,15.9 19.05,15.9
  Bottom 0.61: v14.91,18.39 14.91,18.36 17.4,15.88 v18.03,15.9 | v29.72,8.08 43.76,8.08 45.64,5.94 POWER.6

### Text on the board
Top: NG DM
tNames: M.Banzi | D.Cuartielles | T.Igoe | G.Martino | 3 2 1 0 9 8 | 7 6 5 4 3 2 1 0 | D.Mellis | GND | 1 1 1 1 | DIGITAL | AREF | TX | RX | PWM | PWM | PWM | PWM | PWM | PWM | Arduino Diecimila | TX | Reference Design | RX | CC BY SA 2.5 | 1 | USB | EXT | www.arduino.cc | ANALOG IN | RESET | 3V3 | 5V Gnd Vin | 0 1 2 3 4 5 | Released under the Creative Commons Attribution Share-Alike 2.5 License | http://creativecommons.org/licenses/by-sa/2.5/
tStop: MADE IN | ITALY
Reference: C8 | R7 | R10 | R8 | R9 | C3 | C2 | R12 | R11 | R1 | R2 | C1 | R3 | C4 | C5 | X2 | C7 | C6